# Altium schematic sheet JL7018F8.SchDoc
size 254 x 203 mm; SheetNumber: 2; SheetTotal: 4
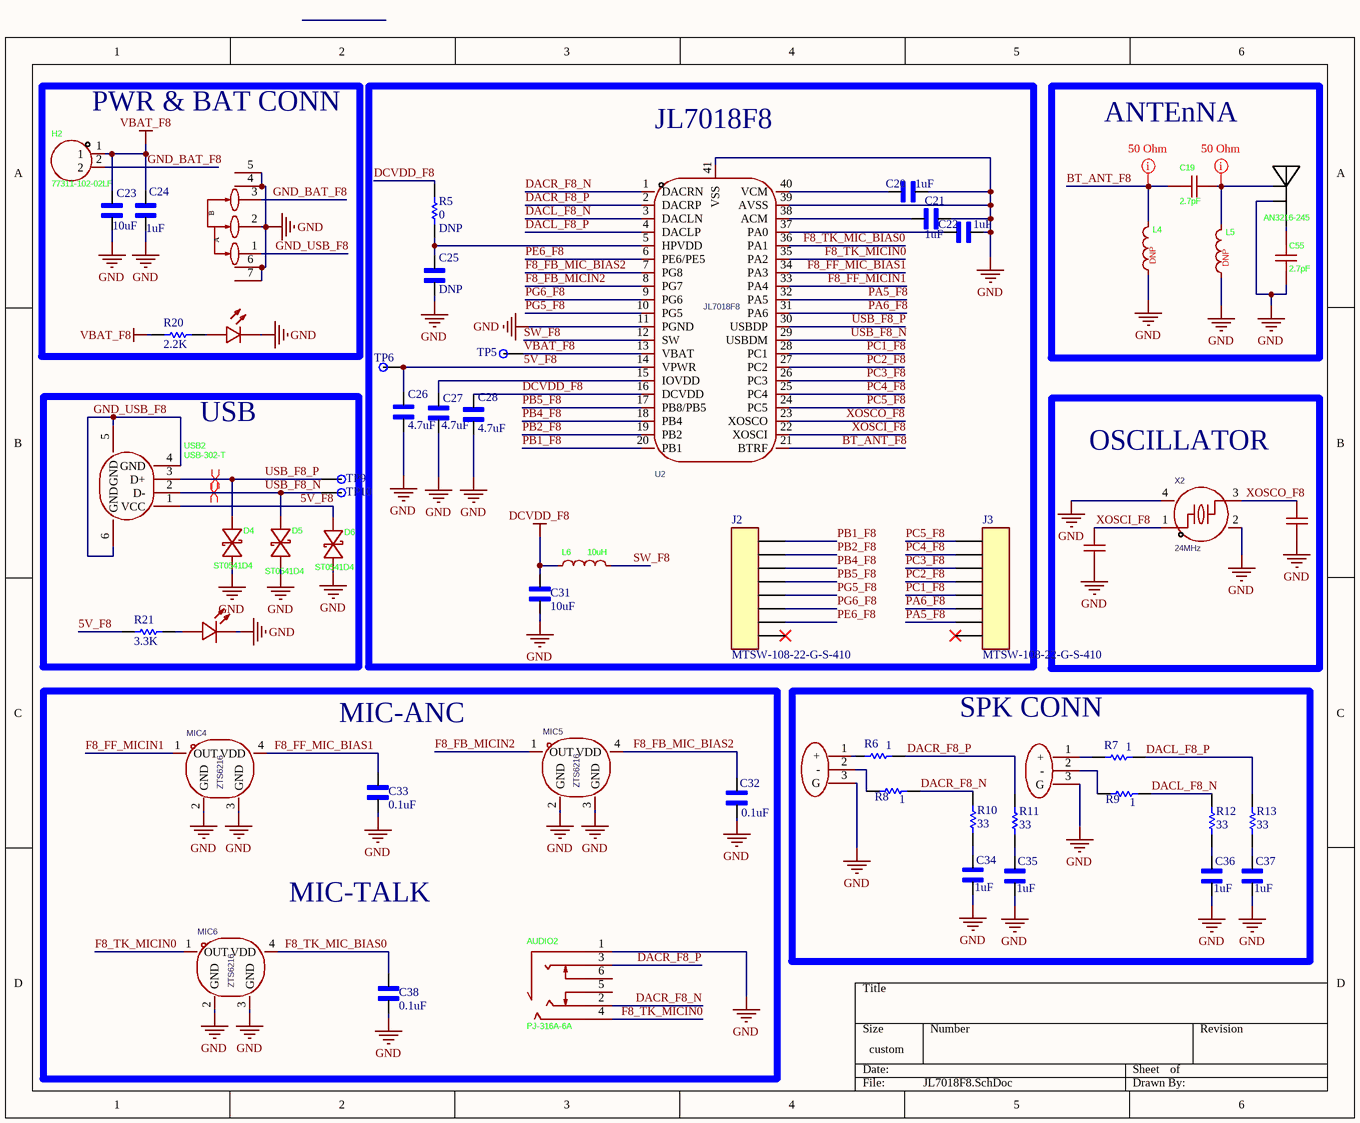
[diagram p0: JL7018F8.SchDoc]

## Parts
ANT2  AN3216-245  [CUSTOME ANTEENA]
AUDIO2  PJ-316A-6A  [AUDIO-SMD_PJ-316A-6A]
C19  2.7pF  [C0603]
C20  1uF  [CAPC3216X170N]
C21  1uF  [CAPC3216X170N]
C22  1uF  [CAPC3216X170N]
C23  10uF  [CAPC3216X170N]
C24  1uF  [CAPC3216X170N]
C25  value DNP  [CAPC3216X170N]  (hidden comment: 1uF)
C26  value 4.7uF  [CAPC3216X170N]  (hidden comment: 1uF)
C27  value 4.7uF  [CAPC3216X170N]  (hidden comment: 1uF)
C28  value 4.7uF  [CAPC3216X170N]  (hidden comment: 1uF)
C29  12pF  [CAPC3216X170N]  (value not drawn)
C30  12pF  [CAPC3216X170N]  (value not drawn)
C31  10uF  [CAPC3216X170N]
C32  0.1uF  [CAPC3216X170N]
C33  0.1uF  [CAPC3216X170N]
C34  1uF  [CAPC3216X170N]
C35  1uF  [CAPC3216X170N]
C36  1uF  [CAPC3216X170N]
C37  1uF  [CAPC3216X170N]
C38  0.1uF  [CAPC3216X170N]
C55  2.7pF  [C0402]
D4  ST0541D4  [DFN1006-BI]
D5  ST0541D4  [DFN1006-BI]
D6  ST0541D4  [DFN1006-BI]
H2  77311-102-02LF  [HDR-TH_2P-P2.54-V-M-1]
J2  MTSW-108-22-G-S-410  [SAMTEC_MTSW-108-22-G-S-410]
J3  MTSW-108-22-G-S-410  [SAMTEC_MTSW-108-22-G-S-410]
L4  DNP  [L0603]
L5  DNP  [L0603]
L6  10uH  [L0603]
LED3  LTST-C191GKT  [LED0603-R-RD_GREEN]  (value not drawn)
LED4  KT-0603R  [LED0603-RD]  (value not drawn)
MIC4  ZTS6216  [MIC-SMD_4P-L2.8-W1.9-P1.84-TL]
MIC5  ZTS6216  [MIC-SMD_4P-L2.8-W1.9-P1.84-TL]
MIC6  ZTS6216  [MIC-SMD_4P-L2.8-W1.9-P1.84-TL]
P2  1.27-1*3P针  [HDR-TH_3P-P1.27-V-M-1]  (value not drawn)
P3  1.27-1*3P针  [HDR-TH_3P-P1.27-V-M-1]  (value not drawn)
R5  DNP  value 0  [R0603]
R6  value 1  [R0603]  (hidden comment: O OHM)
R7  value 1  [R0603]  (hidden comment: O OHM)
R8  value 1  [R0603]  (hidden comment: O OHM)
R9  value 1  [R0603]  (hidden comment: O OHM)
R10  value 33  [R0603]  (hidden comment: 33 Ohm)
R11  value 33  [R0603]  (hidden comment: 33 Ohm)
R12  value 33  [R0603]  (hidden comment: 33 Ohm)
R13  value 33  [R0603]  (hidden comment: 33 Ohm)
R20  value 2.2K  [R1206]
R21  3.3K  [R1206]
SW2  MK-12C02-G015  [SW-SMD_G-SWITCH_MK-12C02-G015]  (value not drawn)
TP5  TP_1  [TP]  (value not drawn)
TP6  TP_1  [TP]  (value not drawn)
TP9  TP  [TP]  (value not drawn)
TP10  TP  [TP]  (value not drawn)
U2  JL7018F8  [QFN-40_L5.0-W5.0-P0.40-TL-EP3.6]
USB2  USB-302-T  [USB-A-TH_USB-302-T]
X2  24MHz  [CRYSTAL-SMD_4P-L2.0-W1.6-BL-A]

## Blocks framed on the sheet
PWR & BAT CONN: C23 C24 H2 LED3 R20 SW2
JL7018F8: C20-C22 C25-C28 C31 J2 J3 L6 R5 TP5 TP6 U2
ANTEnNA: ANT2 C19 C55 L4 L5
USB: D4-D6 LED4 R21 TP9 TP10 USB2
OSCILLATOR: C29 C30 X2
SPK CONN: C34-C37 P2 P3 R6-R13

## Nets
DCVDD_F8: C28.1 C31.2 L6.1 R5.2 U2.16(DCVDD)
GND: ANT2.2 AUDIO2.1 C20.2 C21.2 C22.2 C23.1 C24.2 C25.2 C26.2 C27.2 C28.2 C29.1 C30.1 C31.1 C32.1 C33.1 C34.1 C35.1 C36.1 C37.1 C38.1 C55.1 D4.1 D5.1 D6.1 L4.1 L5.1 LED3.2(C) LED4.1(K) MIC4.2(GND) MIC4.3(GND) MIC5.2(GND) MIC5.3(GND) MIC6.2(GND) MIC6.3(GND) P2.3(G) P3.3(G) SW2.2 SW2.4 SW2.5 SW2.6 SW2.7 U2.11(PGND) U2.39(AVSS) U2.41(VSS) X2.2(GND) X2.4(GND)
VBAT_F8: C23.2 C24.1 H2.1 R20.2 TP5.1 U2.13(VBAT)
5V_F8: C26.1 D6.2 R21.2 TP6.1 U2.14(VPWR) USB2.1(VCC)
BT_ANT_F8: C19.1 L4.2 U2.21(BTRF)
DACL_F8_N: R9.1 R12.1 U2.3(DACLN)
DACL_F8_P: R7.1 R13.1 U2.4(DACLP)
DACR_F8_N: AUDIO2.2 R8.1 R10.1 U2.1(DACRN)
DACR_F8_P: AUDIO2.3 R6.1 R11.1 U2.2(DACRP)
F8_FB_MIC_BIAS2: C32.2 MIC5.4(VDD) U2.7(PG8)
F8_FB_MICIN2: MIC5.1(OUT) U2.8(PG7)
F8_FF_MIC_BIAS1: C33.2 MIC4.4(VDD) U2.34(PA3)
F8_FF_MICIN1: MIC4.1(OUT) U2.33(PA4)
F8_TK_MIC_BIAS0: C38.2 MIC6.4(VDD) U2.36(PA1)
F8_TK_MICIN0: AUDIO2.4 MIC6.1(OUT) U2.35(PA2)
GND_BAT_F8: H2.2 SW2.3
GND_USB_F8: SW2.1 USB2.4(GND) USB2.5(GND) USB2.6(GND)
PA5_F8: J3.07 U2.32(PA5)
PA6_F8: J3.06 U2.31(PA6)
PB1_F8: J2.01 U2.20(PB1)
PB2_F8: J2.02 U2.19(PB2)
PB4_F8: J2.03 U2.18(PB4)
PB5_F8: J2.04 U2.17(PB8/PB5)
PC1_F8: J3.05 U2.28(PC1)
PC2_F8: J3.04 U2.27(PC2)
PC3_F8: J3.03 U2.26(PC3)
PC4_F8: J3.02 U2.25(PC4)
PC5_F8: J3.01 U2.24(PC5)
PE6_F8: J2.07 U2.6(PE6/PE5)
PG5_F8: J2.05 U2.10(PG5)
PG6_F8: J2.06 U2.9(PG6)
SW_F8: L6.2 U2.12(SW)
USB_F8_N: D5.2 TP10.1 U2.29(USBDM) USB2.2(D-)
USB_F8_P: D4.2 TP9.1 U2.30(USBDP) USB2.3(D+)
XOSCI_F8: C30.2 U2.22(XOSCI) X2.1
XOSCO_F8: C29.2 U2.23(XOSCO) X2.3
NetANT2_1: ANT2.1 C19.2 L5.2
NetANT2_3: ANT2.3 C55.2
NetC20_1: C20.1 U2.40(VCM)
NetC21_1: C21.1 U2.38(ACM)
NetC22_1: C22.1 U2.37(PA0)
NetC25_1: C25.1 R5.1 U2.5(HPVDD)
NetC27_1: C27.1 U2.15(IOVDD)
NetC34_2: C34.2 R10.2
NetC35_2: C35.2 R11.2
NetC36_2: C36.2 R12.2
NetC37_2: C37.2 R13.2
NetLED3_1: LED3.1(A) R20.1
NetLED4_2: LED4.2(A) R21.1
NetP2_1: P2.1(+) R6.2
NetP2_2: P2.2(-) R8.2
NetP3_1: P3.1(+) R7.2
NetP3_2: P3.2(-) R9.2

Not connected (* = marked no-connect by the designer): AUDIO2 5 6; J2 08*; J3 08*

## Layout directives
rule Width Constraint [Pref Impedance = 50.00ohms    Min Impedance = 50.00ohms    Max Impedance = 50.00ohms]: BT_ANT_F8, NetANT2_1
differential pair: USB_F8_N, USB_F8_P

## Notes on the sheet
- MIC-ANC
- (near MIC6) MIC-TALK
- (in symbol MK-12C02-G015_C2911519) B; A

## Library data of the parts
ANT2 = AN3216-245: Manufacturer: Rainsun(霖昱微); Add into BOM: yes; Frequency(Center/Band): 2.45GHz; Bandwidth: 100MHz; Peak Gain: 0.5dBi; Impedance: 50Ω; Power: 1W; VSWR: 2.5; Symbol: AN3216-245; Device: AN3216-245; LCSC Part Name: AN3216-245; Supplier Part: C2916136; Manufacturer Part: AN3216-245; Supplier Footprint: 1206; JLCPCB Part Class: Extended Part; Datasheet: https://item.szlcsc.com/datasheet/AN3216-245/3211390.html; Supplier: LCSC; Convert to PCB: yes; Operating Temperature: -40℃~+85℃; Length: 3.2mm; Width: 1.6mm; Height: 1.3mm
AUDIO2 = PJ-316A-6A: Manufacturer: 韩国韩荣; Add into BOM: yes; Connector Type: 3.5mm Headphone Jack; Current Rating: 500mA; Voltage Rating (Max): 30V; Symbol: PJ-316A-6A; Device: PJ-316A-6A; LCSC Part Name: 3.5mm耳机座; Supplier Part: C128987; Manufacturer Part: PJ-316A-6A; Supplier Footprint: SMD; JLCPCB Part Class: Extended Part; Datasheet: https://item.szlcsc.com/datasheet/PJ-316A-6A/140273.html; Supplier: LCSC; Convert to PCB: yes; Contact Material: Phosphor Bronze; Contact Plating: Gold
C19 C55 = 0603CG2R7C500NT: Manufacturer: FH(风华); Add into BOM: yes; Voltage Rating: 50V; Temperature Coefficient: C0G; Symbol: 0603CG2R7C500NT; Device: 0603CG2R7C500NT; LCSC Part Name: ±0.25pF 2.7pF 50V; Supplier Part: C95180; Manufacturer Part: 0603CG2R7C500NT; Supplier Footprint: 0603; JLCPCB Part Class: Extended Part; Datasheet: https://item.szlcsc.com/datasheet/0603CG2R7C500NT/96381.html; Supplier: LCSC; Convert to PCB: yes; Value: 2.7pF
C20-C22 C24-C28 C34-C37 = CAP_1uF
  C20-C22 C24 C34-C37: Value: 1uF
C23 C31 = CAP_10F: Value: 10uF
C29 C30 = 0402CG120J500NT: Manufacturer: FH(风华); Add into BOM: yes; Tolerance: ±5%; Voltage Rating: 50V; Temperature Coefficient: C0G; Symbol: 0402CG120J500NT; Device: 0402CG120J500NT; LCSC Part Name: 12pF ±5% 50V; Supplier Part: C1547; Manufacturer Part: 0402CG120J500NT; Supplier Footprint: 0402; JLCPCB Part Class: Basic Part; Datasheet: https://item.szlcsc.com/datasheet/0402CG120J500NT/1899.html; Supplier: LCSC; Convert to PCB: yes; Value: 12pF
C32 C33 C38 = CAP_0.1uF: 100nF 10V X7R ±5% 0402 Multilayer Ceramic Capacitors MLCC - SMD/SMT ROHS; Manufacturer: Walsin Tech Corp; MFR.Part #: 0402B104J100CT; JLCPCB Part #: C237170; Package: 0402; Value: 0.1uF
D4-D6 = ST0541D4: Manufacturer: Leiditech(雷卯电子); Add into BOM: yes; Reverse Stand-Off Voltage (Vrwm): 5V; Clamping Voltage: 23V; Peak Pulse Power Dissipation (Ppp): 110W@8/20us; Voltage - Breakdown: 6V; Reverse Leakage Current (Ir): 500nA; level of protection: IEC 61000-4-4；IEC 61000-4-5；IEC 61000-4-2; Type: ESD; Junction Capacitance: 0.22pF; Symbol: ST0541D4; Device: ST0541D4; LCSC Part Name: ESD 5V截止; Supplier Part: C5139355; Manufacturer Part: ST0541D4; Supplier Footprint: DFN1006-2; JLCPCB Part Class: Extended Part; Datasheet: https://item.szlcsc.com/datasheet/ST0541D4/5751044.html; Supplier: LCSC; Convert to PCB: yes
H2 = 77311-102-02LF: Manufacturer: Amphenol; Add into BOM: yes; Pitch: 2.54mm; Circluar Pins/Square Pins: Pin Header; Current Rating: 3A; Symbol: 77311-102-02LF; Device: 77311-102-02LF; LCSC Part Name: 间距:2.54mm 方针 直插; Supplier Part: C180247; Manufacturer Part: 77311-102-02LF; Supplier Footprint: 插件,P=2.54mm; JLCPCB Part Class: Extended Part; Datasheet: https://item.szlcsc.com/datasheet/77311-102-02LF/191642.html; Supplier: LCSC; Convert to PCB: yes; Pin Structure: -; Row Spacing: -; Mounting Type: Through Hole; Number of Rows: 1; Number of Pins: 2P; Voltage Rating (Max): -; Length of Mating Pin: -; Insulation Height: 2.54mm; Contact Material: Phosphor Bronze; Contact Plating: Tin; Operating Temperature: -65℃~+125℃; Color: Black
L4 L5 = 33nH: Manufacturer: muRata(村田); Symbol: DFE18SAN1R0ME0L; Add into BOM: yes; Value: 1uH; Tolerance: ±20%; Current Rating: 1.6A; DC Resistance(DCR): 144mΩ; Device: DFE18SAN1R0ME0L; LCSC Part Name: 1uH ±20%; Supplier Part: C2044564; Manufacturer Part: DFE18SAN1R0ME0L; Supplier Footprint: 0603; JLCPCB Part Class: Extended Part; Datasheet: https://atta.szlcsc.com/upload/public/pdf/source/20210601/1EEB72040C737E24AB5C3900F417DA4B.pdf; Supplier: LCSC; Convert to PCB: yes; Current - Saturation (Isat): -; Q @ Frequency: -; Frequency - Self Resonant: -; Ratings: -
L6 = 10uH: Value: 1uH; LCSC Part Name: 1uH ±20%; Q @ Frequency: -; Frequency - Self Resonant: -; Ratings: -
LED3 = LTST-C191GKT: -55℃~+85℃ 100mW 12mcd 130° 2.1V 20mA 565nm 569nm Discrete Diode Green Water Clear 0603 LED Indication - Discrete ROHS; Manufacturer: LITEON(光宝); Add into BOM: yes; Symbol: LTST-C191GKT; Device: LTST-C191GKT; LCSC Part Name: LTST-C191GKT; Supplier Part: C99289; Manufacturer Part: LTST-C191GKT; Supplier Footprint: 0603; JLCPCB Part Class: Extended Part; Datasheet: https://item.szlcsc.com/datasheet/LTST-C191GKT/100502.html; Supplier: LCSC; Convert to PCB: yes; Illumination Color: -; Voltage - Forward(Vf): 2.1V; Power(Watts): 100mW; Forward Current: 20mA; Wavelength - Dominant: 569nm; Peak Wavelength: 565nm; Diode Configuration: -; Lens Color: Water Clear; Color Temperature: -; Luminous Intensity: 12mcd; Viewing Angle: 130°; Mounting Style: -; Operating Temperature: -55℃~+85℃
LED4 = KT-0603R: Manufacturer: KENTO; Add into BOM: yes; Emitted Color: Red; Symbol: KT-0603R; Device: KT-0603R; LCSC Part Name: 0603 红灯 高亮; Supplier Part: C2286; Manufacturer Part: KT-0603R; Supplier Footprint: 0603; JLCPCB Part Class: Basic Part; Datasheet: https://atta.szlcsc.com/upload/public/pdf/source/20160616/1466072038404.pdf; Supplier: LCSC; Convert to PCB: yes; Power Dissipation: -; Forward Current: -; Dominant Wavelength: -; Peak Wavelength: -; Diode Configuration: -; Lens Color: -; Color Temperature: -; Viewing Angle: -; Mounting Sytle: -; Operating Temperature: -40℃~+85℃
MIC4-MIC6 = ZTS6216: Manufacturer: ZILLTEK(钰太); Add into BOM: yes; Direction: Omnidirectional; Voltage - Supply: 1.5V~3.6V; Current Consumption: 120uA; S/N Ratio: 65dB; Sensitivity: -38dB; Impedance: 100Ω; Output Type: 模拟输出; Symbol: ZTS6216; Device: ZTS6216; LCSC Part Name: 1.5V~3.6V38dB; Supplier Part: C481302; Manufacturer Part: ZTS6216; Supplier Footprint: SMD-4P,2.8x1.9mm; JLCPCB Part Class: Extended Part; Datasheet: https://item.szlcsc.com/datasheet/ZTS6216/488750.html; Supplier: LCSC; Convert to PCB: yes; Length: 2.75mm; Width: 1.85mm; Height: 1mm
P2 P3 = 1.27-1*3P针: Manufacturer: BOOMELE(博穆精密); Symbol: 1.27mm/1*3p; Add into BOM: yes; Pin Structure: 1x3P; Pitch: 1.27mm; Circluar Pins/Square Pins: Pin Header; Current Rating: 3A; Device: 1.27-1*3P针; LCSC Part Name: 1x3P 间距:1.27mm 方针 直插; Supplier Part: C24980; Manufacturer Part: 1.27-1*3P针; Supplier Footprint: 插件,P=1.27mm; JLCPCB Part Class: Extended Part; Datasheet: https://item.szlcsc.com/datasheet/1.27-1*3P%25E9%2592%2588/25717.html; Supplier: LCSC; Convert to PCB: yes; Row Spacing: -; Mounting Type: Through Hole; Number of Rows: 1; Number of Pins: 3P; Voltage Rating (Max): -; Length of Mating Pin: 3mm; Insulation Height: 1.7mm; Length of End Connection Pin: 2.5mm; Contact Material: Brass; Contact Plating: -; Operating Temperature: -55℃~+105℃; Color: Black; Supplementary Features: -
R5 = RES_0: -55℃~+155℃ 0Ω 50V 62.5mW Thick Film Resistor ±5% 0402 Chip Resistor - Surface Mount ROHS; Manufacturer: RALEC; MFR.Part #: RTT02000JTH; JLCPCB Part #: C102746; Package: 0402
R6-R9 = RES_1: -55℃~+155℃ 33Ω 50V 62.5mW Thick Film Resistor ±100ppm/℃ ±5% 0402 Chip Resistor - Surface Mount ROHS; Manufacturer: YAGEO; MFR.Part #: RC0402JR-0733RL; JLCPCB Part #: C137880; Package: 0402
R10-R13 = RES_33: -55℃~+155℃ 33Ω 50V 62.5mW Thick Film Resistor ±100ppm/℃ ±5% 0402 Chip Resistor - Surface Mount ROHS; Manufacturer: YAGEO; MFR.Part #: RC0402JR-0733RL; JLCPCB Part #: C137880; Package: 0402
R20 = RES_2.2K: -55℃~+155℃ 33Ω 50V 62.5mW Thick Film Resistor ±100ppm/℃ ±5% 0402 Chip Resistor - Surface Mount ROHS; Manufacturer: YAGEO; MFR.Part #: RC0402JR-0733RL; JLCPCB Part #: C137880; Package: 0402
R21 = RES_3.3K: -55℃~+155℃ 33Ω 50V 62.5mW Thick Film Resistor ±100ppm/℃ ±5% 0402 Chip Resistor - Surface Mount ROHS; Manufacturer: YAGEO; MFR.Part #: RC0402JR-0733RL; JLCPCB Part #: C137880; Package: 0402; Value: 3.3K
SW2 = MK-12C02-G015_C2911519: Manufacturer: G-Switch(品赞); Add into BOM: yes; Circuit: SPDT; Actuator Style: Rectangular Columnar; Switch Height: 4.2mm; Actuator Color: Black; Current Rating: 1A; Voltage Rating: 6V; Life: 10,000 Cycles; Symbol: MK-12C02-G015; Device: MK-12C02-G015_C2911519; LCSC Part Name: 七脚贴片微型拨动开关 G1.5; Supplier Part: C2911519; Manufacturer Part: MK-12C02-G015; Supplier Footprint: SMD,6.6x1.4mm; JLCPCB Part Class: Extended Part; Datasheet: https://item.szlcsc.com/datasheet/MK-12C02-G015/3191561.html; Supplier: LCSC; Convert to PCB: yes; Termination Style: -; Length: 6.6mm; Width: 1.4mm; Mounting Type: Surface Mount, Right Angle; Operating Temperature: -20℃~+70℃
TP5 TP6 = TP_1: test point
TP9 TP10 = TP: test point
U2 = JL7018F8: Manufacturer: JL(杰理); Add into BOM: yes; Symbol: JL7018F8; Device: JL7018F8; LCSC Part Name: JL7018F8; Supplier Part: C22440784; Manufacturer Part: JL7018F8; Supplier Footprint: QFN-40(5x5); JLCPCB Part Class: Extended Part; Datasheet: https://atta.szlcsc.com/upload/public/pdf/source/20240530/C76432E100E871E73B9BDB95A008B29A.pdf; Supplier: LCSC; Convert to PCB: yes
USB2 = USB-302-T: Manufacturer: SOFNG(硕方); Add into BOM: yes; Connector Type: Type-A; Protocol Standard: USB 2.0; Gender: Female; Number of Contacts: 4P; Number of Ports: 1; Current Rating-Power: 50mA; Voltage Rating: 24V; Detection color: White; Symbol: USB-302; Device: USB-302-T; LCSC Part Name: Type-A 母 弯插; Supplier Part: C112456; Manufacturer Part: USB-302-T; Supplier Footprint: 弯插; JLCPCB Part Class: Extended Part; Datasheet: https://item.szlcsc.com/datasheet/USB-302-T/113689.html; Supplier: LCSC; Convert to PCB: yes; Mounting Type: Right Angle; Operating Temperature: -25℃~+75℃
X2 = XL7EL89CKI-111YLC-24M: Manufacturer: YXC(扬兴晶振); Add into BOM: yes; Normal temperature Frequency Tolerance: ±10ppm; Load Capacitance: 8pF; Frequency Stability: ±20ppm; Symbol: XL7EL89CKI-111YLC-24M; Device: XL7EL89CKI-111YLC-24M; LCSC Part Name: YSX211SL 24MHZ 4P 2016 8PF ±10PPM -40~85℃ (±20PPM); Supplier Part: C2965580; Manufacturer Part: XL7EL89CKI-111YLC-24M; Supplier Footprint: SMD2016-4P; JLCPCB Part Class: Extended Part; Datasheet: https://item.szlcsc.com/datasheet/XL7EL89CKI-111YLC-24M/3357716.html; Supplier: LCSC; Convert to PCB: yes; Type: Surface Mount Crystal; Value: 24MHz; Equivalent Series Resistance(ESR): -; Operating Temperature: -40℃~+85℃
J2 J3 = MTSW-108-22-G-S-410: MP: MTSW-108-22-G-S-410; Price: None; Package: None; Value: *; Availability: Unavailable